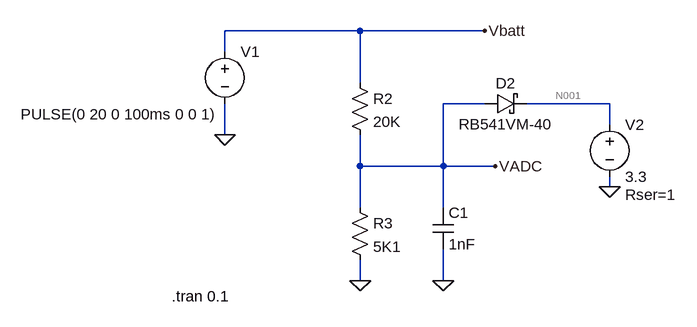
[diagram p0: schematic AdcDivider1.asc]
AdcDivider1.asc, the LTspice schematic file:
Version 4
SHEET 1 880 680
WIRE 208 32 0 32
WIRE 400 32 208 32
WIRE 0 64 0 32
WIRE 208 112 208 32
WIRE 400 144 336 144
WIRE 592 144 464 144
WIRE 592 176 592 144
WIRE 0 192 0 144
WIRE 208 240 208 192
WIRE 336 240 336 144
WIRE 336 240 208 240
WIRE 416 240 336 240
WIRE 592 272 592 256
WIRE 208 304 208 240
WIRE 336 304 336 240
WIRE 208 416 208 384
WIRE 336 416 336 368
FLAG 208 416 0
FLAG 0 192 0
FLAG 336 416 0
FLAG 416 240 VADC
FLAG 400 32 Vbatt
FLAG 592 272 0
SYMBOL res 192 96 R0
SYMATTR InstName R2
SYMATTR Value 20K
SYMBOL res 192 288 R0
SYMATTR InstName R3
SYMATTR Value 5K1
SYMBOL voltage 0 48 R0
WINDOW 3 -314 112 Left 2
WINDOW 123 0 0 Left 0
WINDOW 39 0 0 Left 0
SYMATTR InstName V1
SYMATTR Value PULSE(0 20 0 100ms 0 0 1)
SYMBOL cap 320 304 R0
SYMATTR InstName C1
SYMATTR Value 1nF
SYMBOL voltage 592 160 R0
WINDOW 123 0 0 Left 0
WINDOW 39 24 124 Left 2
SYMATTR InstName V2
SYMATTR Value 3.3
SYMATTR SpiceLine Rser=1
SYMBOL schottky 400 160 R270
WINDOW 0 32 32 VTop 2
WINDOW 3 0 32 VBottom 2
SYMATTR InstName D2
SYMATTR Value RB541VM-40
SYMATTR Description Diode
SYMATTR Type diode
TEXT -82 440 Left 2 !.tran 0.1

The netlist it stands for:
* AdcDivider1.asc
R2 Vbatt VADC 20K
R3 VADC 0 5K1
V1 Vbatt 0 PULSE(0 20 0 100ms 0 0 1)
C1 VADC 0 1nF
V2 N001 0 3.3 Rser=1
D2 VADC N001 RB541VM-40
.model D D
.lib standard.dio
.tran 0.1
.backanno
.end

* Results of the author's LTspice run, read from the files saved beside the schematic
* Operating Point, zero values left out:
*   V(vadc) = 10.06 mV
*   V(n001) = 3.3 V
*   I(D2) = -2.477 µA
*   I(R3) = 1.973 µA
*   I(R2) = -503.2 nA
*   I(V2) = -2.477 µA
*   I(V1) = 503.2 nA
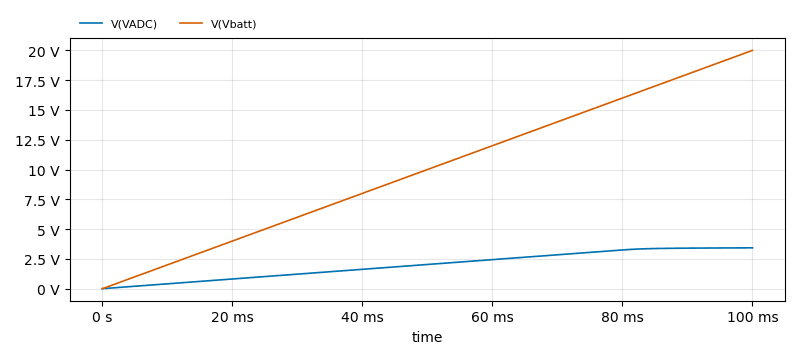
[diagram p1: Transient Analysis of AdcDivider1.asc, plotted from the saved traces]
* Transient Analysis, 1 run:
*   V(VADC): min 10.06 mV, max 3.436 V, average 1.986 V, rms 2.306 V, last 3.436 V
*   V(Vbatt): min 0 V, max 20 V, average 10 V, rms 11.73 V, last 20 V